# Altium schematic sheet DAC.SchDoc: DAC / ADC
size B; CheckedBy: Jude Thibeault; Engineer: Kyle Dick; Revision: 1; SheetNumber: 5; SheetTotal: 9
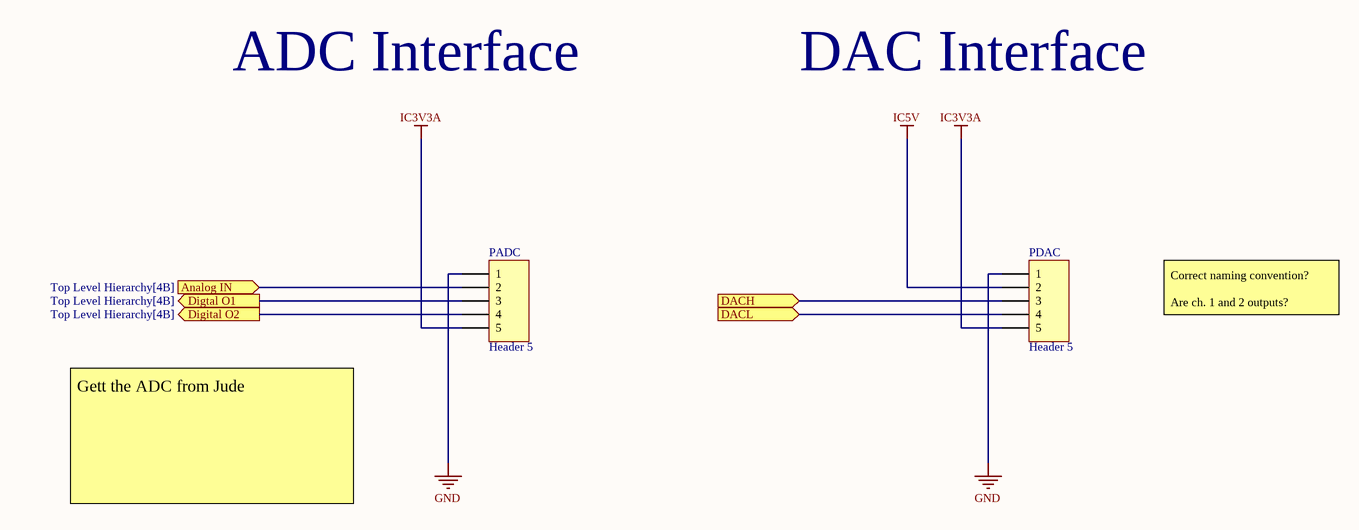
[diagram p0: DAC.SchDoc]

## Parts
PADC  Header 5  [HDR1X5]
PDAC  Header 5  [HDR1X5]

## Ports
Analog IN (in, see Top Level Hierarchy[4B]), DACH (in, see Top Level Hierarchy[4B]), DACL (in, see Top Level Hierarchy[4B]), Digital O2 (out, see Top Level Hierarchy[4B]), Digtal O1 (out, see Top Level Hierarchy[4B])

## Nets
GND: PADC.1 PDAC.1
IC3V3A: PADC.5 PDAC.5
IC5V: PDAC.2
Analog IN: PADC.2 ; port Analog IN
DACH: PDAC.3 ; port DACH
DACL: PDAC.4 ; port DACL
Digital O2: PADC.4 ; port Digital O2
Digtal O1: PADC.3 ; port Digtal O1

## Notes on the sheet
- ADC Interface
- DAC Interface
- Correct naming convention?
  Are ch. 1 and 2 outputs?
- Gett the ADC from Jude
- ESE
- is the sole property of ESE. Any reproduction
- The Information Contained in this drawing
- Schematic P/N and Name
- Sheet Name
- 850 Fountain St. S.
- Cambridge, ON N3H 0A8
- Canada
- Approved
- in part or in whole without the written
- permission of ESE is strictly prohibited.
- APPROVALS
- DATE
- Size
- Scale
- B
- NTS
- Bare PCB P/N
- Date
- Sheet
- Rev.
- Checked
- Created
- of

## Library data of the parts
PADC PDAC = Header 5: Header, 5-Pin Male; MPN: PEC05SFAN; PN: S1212E-05-ND; URL: http://www.digikey.ca/product-detail/en/PEC05SFAN/S1212E-05-ND/859446